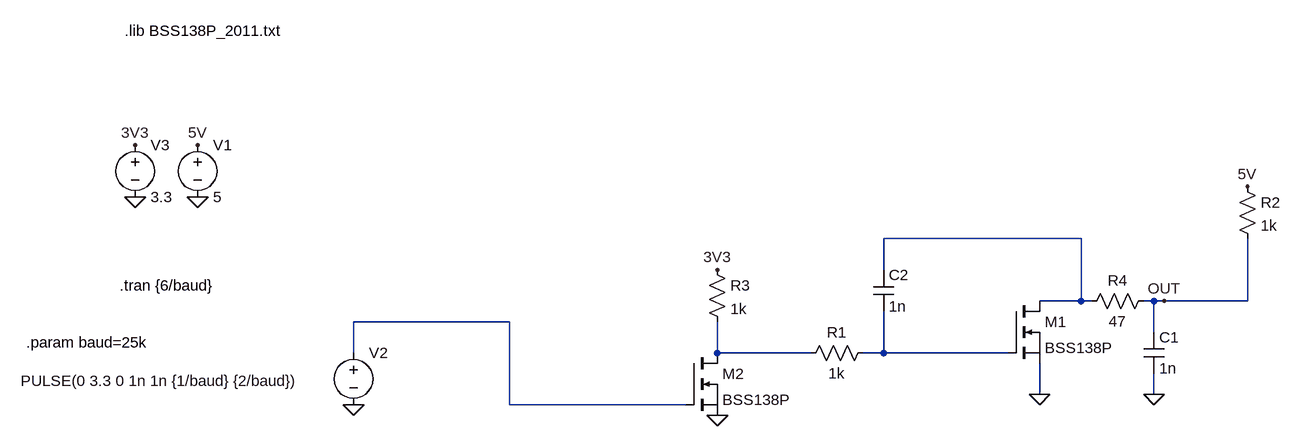
[diagram p0: schematic slew_rate.asc]
slew_rate.asc, the LTspice schematic file:
Version 4
SHEET 1 1400 680
WIRE 1088 80 784 80
WIRE 784 128 784 80
WIRE 1088 176 1088 80
WIRE 1088 176 1024 176
WIRE 1104 176 1088 176
WIRE 1200 176 1184 176
WIRE 1216 176 1200 176
WIRE 1344 176 1344 80
WIRE 1344 176 1216 176
WIRE 208 208 -32 208
WIRE 1200 224 1200 176
WIRE -32 256 -32 208
WIRE 528 256 528 208
WIRE 672 256 528 256
WIRE 784 256 784 192
WIRE 784 256 752 256
WIRE 976 256 784 256
WIRE 1024 320 1024 272
WIRE 1200 320 1200 288
WIRE 208 336 208 208
WIRE 480 336 208 336
FLAG -368 16 0
FLAG -272 16 0
FLAG -32 336 0
FLAG -272 -64 5V
FLAG 1344 0 5V
FLAG -368 -64 3V3
FLAG 1216 176 OUT
FLAG 1024 320 0
FLAG 528 352 0
FLAG 528 128 3V3
FLAG 1200 320 0
SYMBOL voltage -272 -80 R0
WINDOW 123 0 0 Left 0
WINDOW 39 0 0 Left 0
SYMATTR InstName V1
SYMATTR Value 5
SYMBOL voltage -32 240 R0
WINDOW 3 -512 59 Left 2
WINDOW 123 0 0 Left 0
WINDOW 39 0 0 Left 0
SYMATTR Value PULSE(0 3.3 0 1n 1n {1/baud} {2/baud})
SYMATTR InstName V2
SYMBOL res 1328 -16 R0
SYMATTR InstName R2
SYMATTR Value 1k
SYMBOL voltage -368 -80 R0
WINDOW 123 0 0 Left 0
WINDOW 39 0 0 Left 0
SYMATTR InstName V3
SYMATTR Value 3.3
SYMBOL res 768 240 R90
WINDOW 0 0 56 VBottom 2
WINDOW 3 32 56 VTop 2
SYMATTR InstName R1
SYMATTR Value 1k
SYMBOL nmos 480 256 R0
SYMATTR InstName M2
SYMATTR Value BSS138P
SYMATTR Prefix X
SYMBOL res 512 112 R0
SYMATTR InstName R3
SYMATTR Value 1k
SYMBOL nmos 976 176 R0
SYMATTR InstName M1
SYMATTR Value BSS138P
SYMATTR Prefix X
SYMBOL cap 768 128 R0
SYMATTR InstName C2
SYMATTR Value 1n
SYMBOL res 1200 160 R90
WINDOW 0 0 56 VBottom 2
WINDOW 3 32 56 VTop 2
SYMATTR InstName R4
SYMATTR Value 47
SYMBOL cap 1184 224 R0
SYMATTR InstName C1
SYMATTR Value 1n
TEXT -384 -240 Left 2 !.lib BSS138P_2011.txt
TEXT -392 152 Left 2 !.tran {6/baud}
TEXT -536 240 Left 2 !.param baud=25k

The netlist it stands for:
* slew_rate.asc
V1 5V 0 5
V2 N002 0 PULSE(0 3.3 0 1n 1n {1/baud} {2/baud})
R2 5V OUT 1k
V3 3V3 0 3.3
R1 N004 N003 1k
XM2 N003 N002 0 BSS138P  ; pins D G S
R3 3V3 N003 1k
XM1 N001 N004 0 BSS138P  ; pins D G S
C2 N001 N004 1n
R4 OUT N001 47
C1 OUT 0 1n
.lib BSS138P_2011.txt
.tran {6/baud}
.param baud=25k
.backanno
.end